# EAGLE design PowerDeliveryBoard (EAGLE 9.6.2)
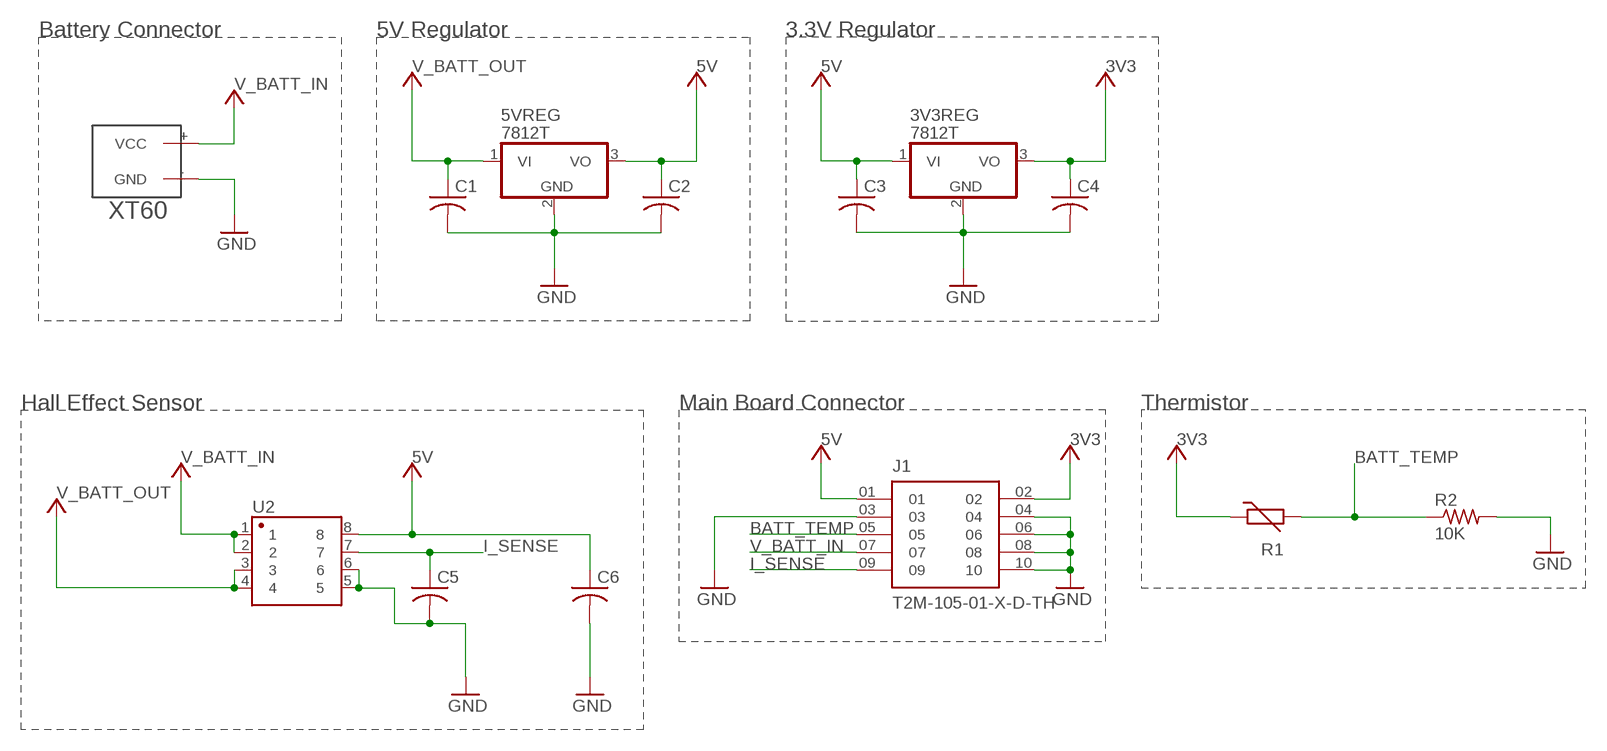
[diagram p0: schematic, sheet 1]

## Parts
3V3REG  7812T  [TO220H]
5VREG  7812T  [TO220H]
C1  C-USC0805  [C0805]
C2  C-USC0805  [C0805]
C3  C-USC0805  [C0805]
C4  C-USC0805  [C0805]
C5  C-USC0805  [C0805]
C6  C-USC0805  [C0805]
J1  T2M-105-01-X-D-TH  [SAMTEC_T2M-105-01-X-D-TH]
R1  THERMISTOR-5  [R-5]
R2  10K  R-US_R0805  [R0805]
U2  ASC723  GENERIC-SOIC8MSGEQ7N-FILTER  [SO08]
U$3  XT60_XT60  [XT60_XT60]

## Nets
3V3: 3V3REG.3(VO) C4.1 J1.02 R1.1 ; supply symbol labelled VCC
5V: 3V3REG.1(VI) 5VREG.3(VO) C2.1 C3.1 C6.1 J1.01 U2.8 ; supply symbol labelled VCC
BATT_TEMP: J1.05 R1.2 R2.1
GND: 3V3REG.2(GND) 5VREG.2(GND) C1.2 C2.2 C3.2 C4.2 C5.2 C6.2 J1.03 J1.04 J1.06 J1.08 J1.10 R2.2 U2.5 U2.6 U$3.-(GND)
I_SENSE: C5.1 J1.09 U2.7
V_BATT_IN: J1.07 U2.1 U2.2 U$3.+(VCC) ; supply symbol labelled VCC
V_BATT_OUT: 5VREG.1(VI) C1.1 U2.3 U2.4 ; supply symbol labelled VCC

## Notes on the sheet
- Battery Connector | 5V Regulator | 3.3V Regulator
- Hall Effect Sensor | Main Board Connector | Thermistor

## Library data of the parts
3V3REG 5VREG = adafruit(seeIMUBreakout):78*: Positive VOLTAGE REGULATOR Added bigger pads to the TO-92 package
C1-C6 = adafruit(seeIMUBreakout):C-US: CAPACITOR, American symbol
J1 = T2M-105-01-X-D-TH:T2M-105-01-X-D-TH; MANUFACTURER: Samtec; MAXIMUM_PACKAGE_HEIGHT: 6.55mm; PARTREV: AH; STANDARD: Manufacturer Recommendations
R1 = varistor:THERMISTOR: THERMISTOR
R2 = adafruit(seeIMUBreakout):R-US_: RESISTOR, American symbol
U2 = SparkFun-Retired:GENERIC-SOIC8: A placeholder for generic narrow & wide SOIC8 foorptints - used on the DIP adapter board. Has strange reference to IC-10141, a Seven Band Graphic Equalizer Display Filter SOIC-8 VFP: IC-10141; PROD_ID: IC-10141
U$3 = XT60_LipoConnector:XT60_XT60: XT60

## Board
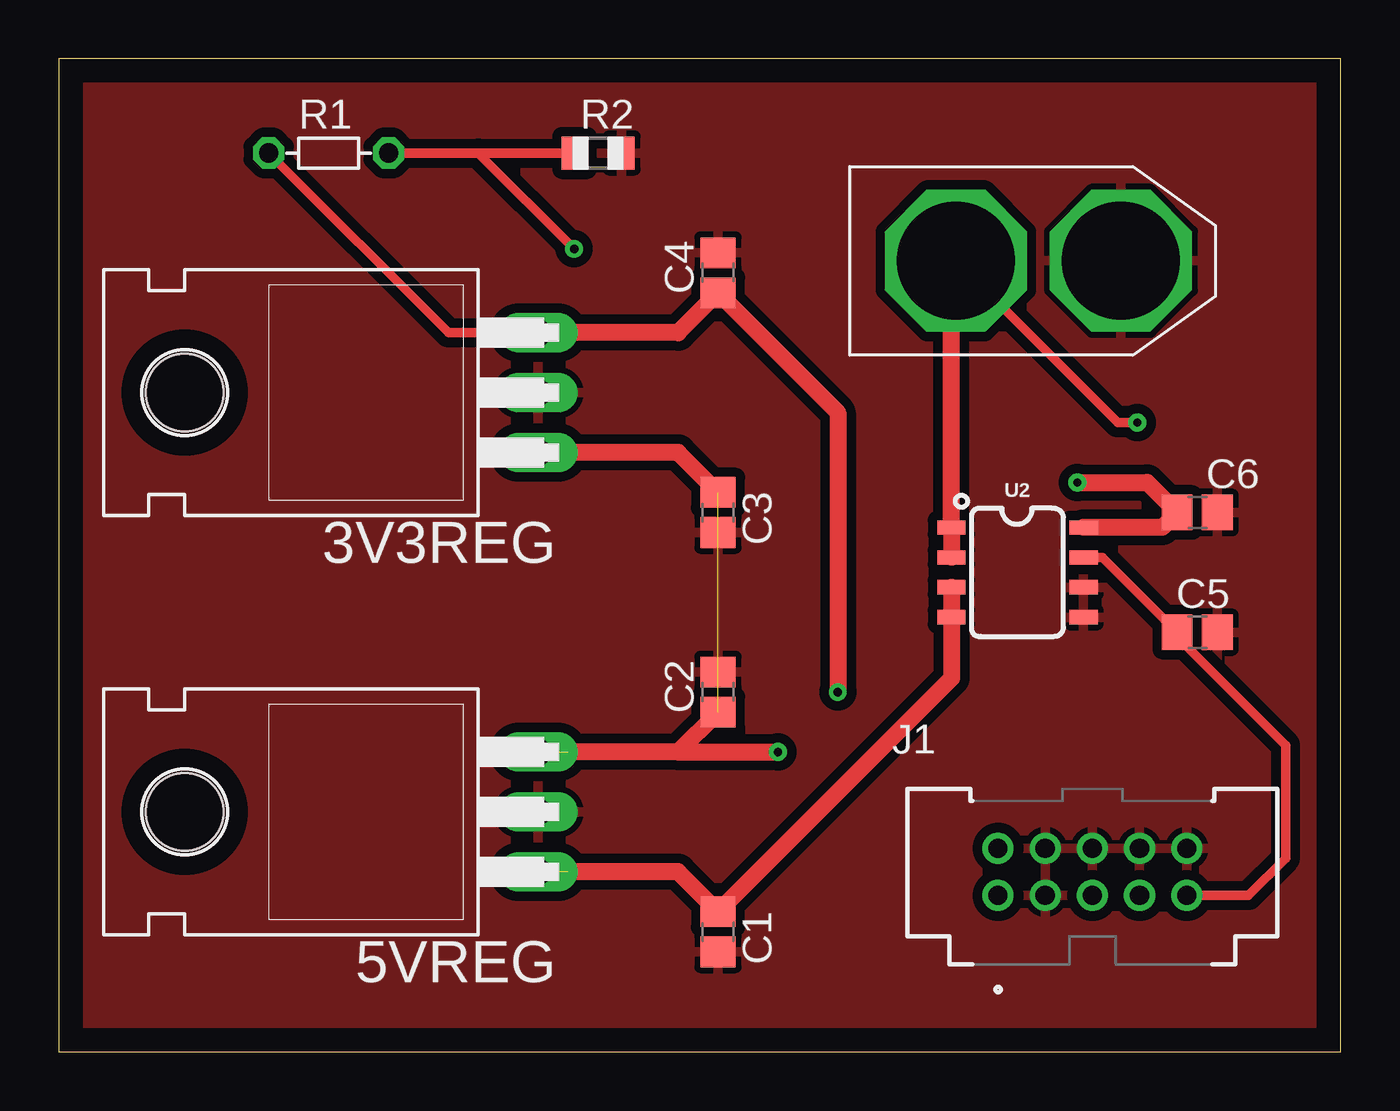
[diagram p1: board, top side]
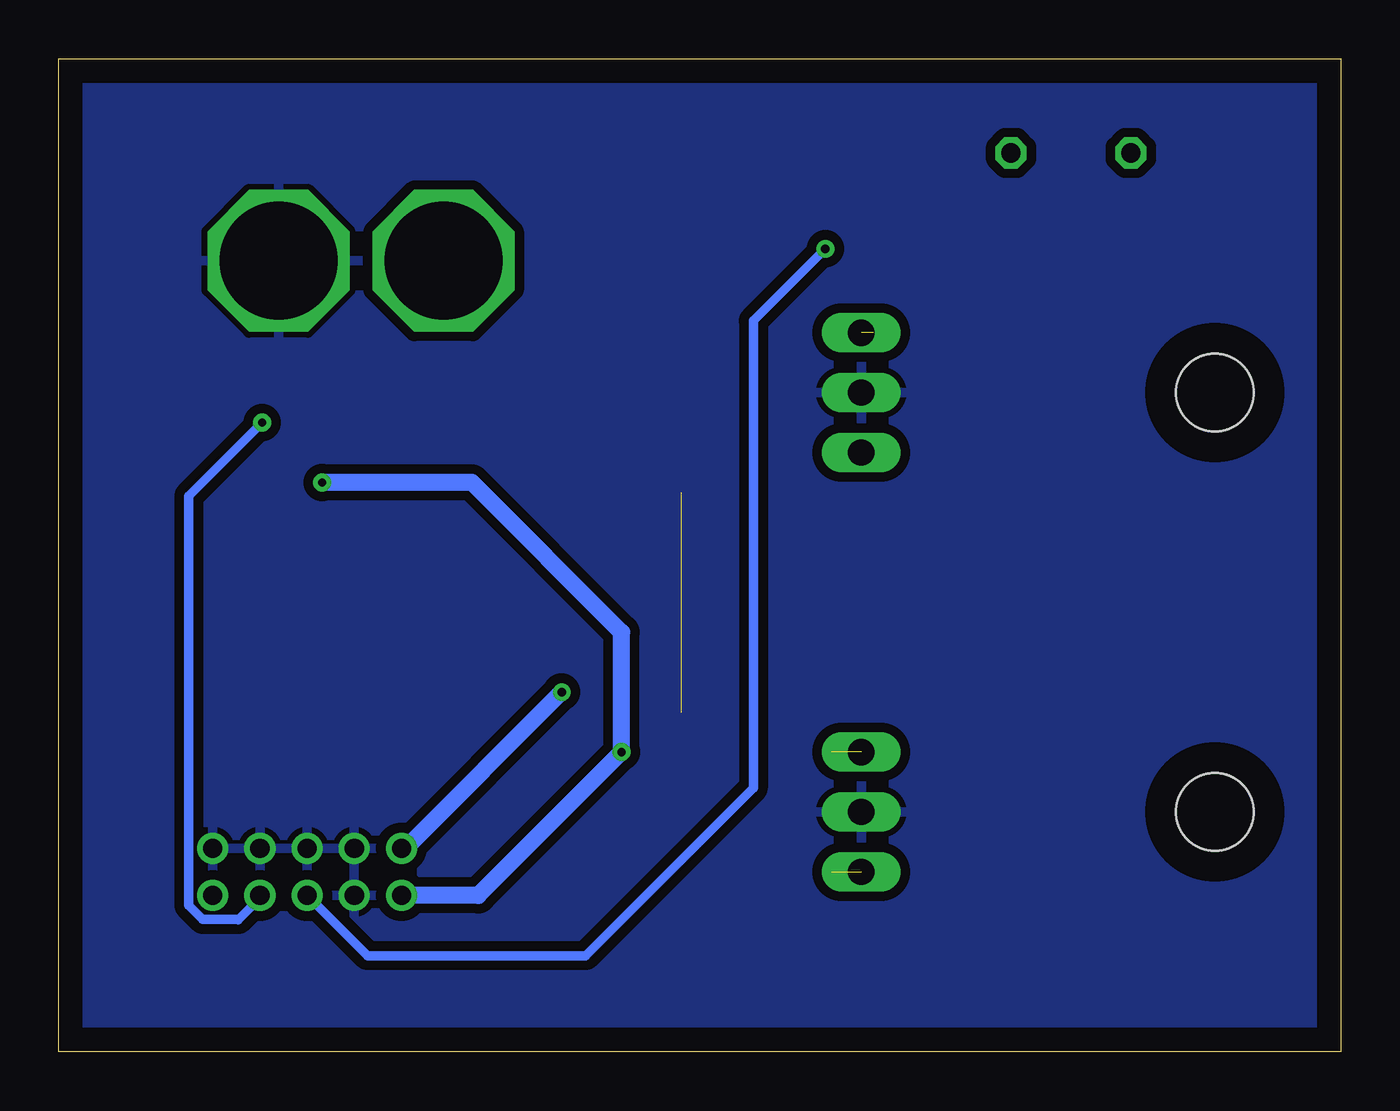
[diagram p2: board, bottom side, seen from below]

Size 54.34 x 42.09 mm. Coordinates in mm from the lower left corner, seen from the top.
Outline: 0,0 54.34,0 54.34,42.09 0,42.09 0,0
Copper layers (1*16): Top 0.035mm / dielectric 1.5mm / Bottom 0.035mm
Design rules "default": minimum track width 6mil, minimum drill 0.35mm, track to track 6mil, track to pad 6mil, pad to pad 6mil, via to via 6mil, smd to smd 6mil, copper to edge 40mil, drill to drill 6mil, minimum pad ring 10mil, minimum via ring 8mil, stop-mask expansion 4mil, vias tented up to drill 0mil, thermal gap 10mil

### Footprints (pad centres in the part's own frame; a part is rotated, then mirrored left to right if it is on the bottom)
TO220H = drill 1.118 long: 1 -2.54,-10.16; 2 0,-10.16; 3 2.54,-10.16 | hole 3.302: 0,4.826
C0805 = smd 1.3 x 1.5: 1 -0.85,0; 2 0.85,0
SAMTEC_T2M-105-01-X-D-TH = drill 0.813 pad 1.163: 01 -4,-1; 02 -4,1; 03 -2,-1; 04 -2,1; 05 0,-1; 06 0,1; 07 2,-1; 08 2,1; 09 4,-1; 10 4,1
R-5 = drill 0.813 octagon: 1 -2.54,0; 2 2.54,0
R0805 = smd 1.1 x 1.4: 1 -1,0; 2 1,0
SO08 = smd 0.6 x 1.2: 1 -1.905,-2.8; 2 -0.635,-2.8; 3 0.635,-2.8; 4 1.905,-2.8; 5 1.905,2.8; 6 0.635,2.8; 7 -0.635,2.8; 8 -1.905,2.8
XT60_XT60 = drill 5 octagon: + 4.5,0; - 11.5,0

### Placement (x,y rotation side)
3V3REG  10.16,27.94 90 top
5VREG  10.16,10.16 90 top
C1  27.94,5.08 270 top
C2  27.94,15.24 90 top
C3  27.94,22.86 270 top
C4  27.94,33.02 90 top
C5  48.26,17.78 0 top
C6  48.26,22.86 0 top
J1  43.81,7.62 0 top
R1  11.43,38.1 0 top
R2  22.86,38.1 0 top
U2  40.64,20.32 270 top
U$3  33.53,33.53 0 top

### Tracks (layer width: path | path; a pad name or v marks a point on that pad's centre or on a via)
3V3  (via drill 0.35)  (1 unrouted)
  Top 0.406: R1.1 16.51,30.48 19.81,30.48
  Top 0.711: 3V3REG.3 26.25,30.48 C4.1 33.02,27.09 v33.02,15.24
  Bottom 0.711: v33.02,15.24 39.64,8.62 J1.02
5V  (via drill 0.35)  (2 unrouted)
  Top 0.711: C3.1 26.25,25.4 3V3REG.1 | 26.25,12.7 C2.1 | 26.25,12.7 21.59,12.7 | 26.25,12.7 v30.48,12.7 | v43.18,24.13 46.14,24.13 C6.1 46.77,22.23 U2.8
  Bottom 0.711: v43.18,24.13 36.83,24.13 30.48,17.78 v30.48,12.7 36.56,6.62 J1.01
BATT_TEMP  (via drill 0.35)
  Top 0.406: R1.2 17.78,38.1 | 17.78,38.1 R2.1 | 17.78,38.1 v21.84,34.04
  Bottom 0.406: v21.84,34.04 24.89,30.99 24.89,11.18 32,4.06 41.26,4.06 J1.05
GND
  pour Top (isolate 0.406): 0,42.16 54.36,42.16 54.36,0 0,0
  pour Bottom (isolate 0.406): 0,42.16 54.36,42.16 54.36,0 0,0
I_SENSE
  Top 0.406: U2.7 44.23,20.95 C5.1 47.41,17.58 52.01,12.98 52.01,8.2 50.43,6.62 J1.09
V_BATT_IN  (via drill 0.35)
  Top 0.406: v45.72,26.67 44.89,26.67 U$3.+
  Top 0.711: U2.2 U2.1 37.84,33.34 U$3.+
  Bottom 0.406: v45.72,26.67 48.83,23.56 48.83,6.2 48.24,5.6 46.75,5.6 46.74,5.59 45.81,6.51 J1.07
V_BATT_OUT  (1 unrouted)
  Top 0.711: 21.59,7.62 26.25,7.62 C1.1 37.84,15.83 U2.4 U2.3